# EAGLE schematic MySLipo_v2.0 (EAGLE 9.2.2)
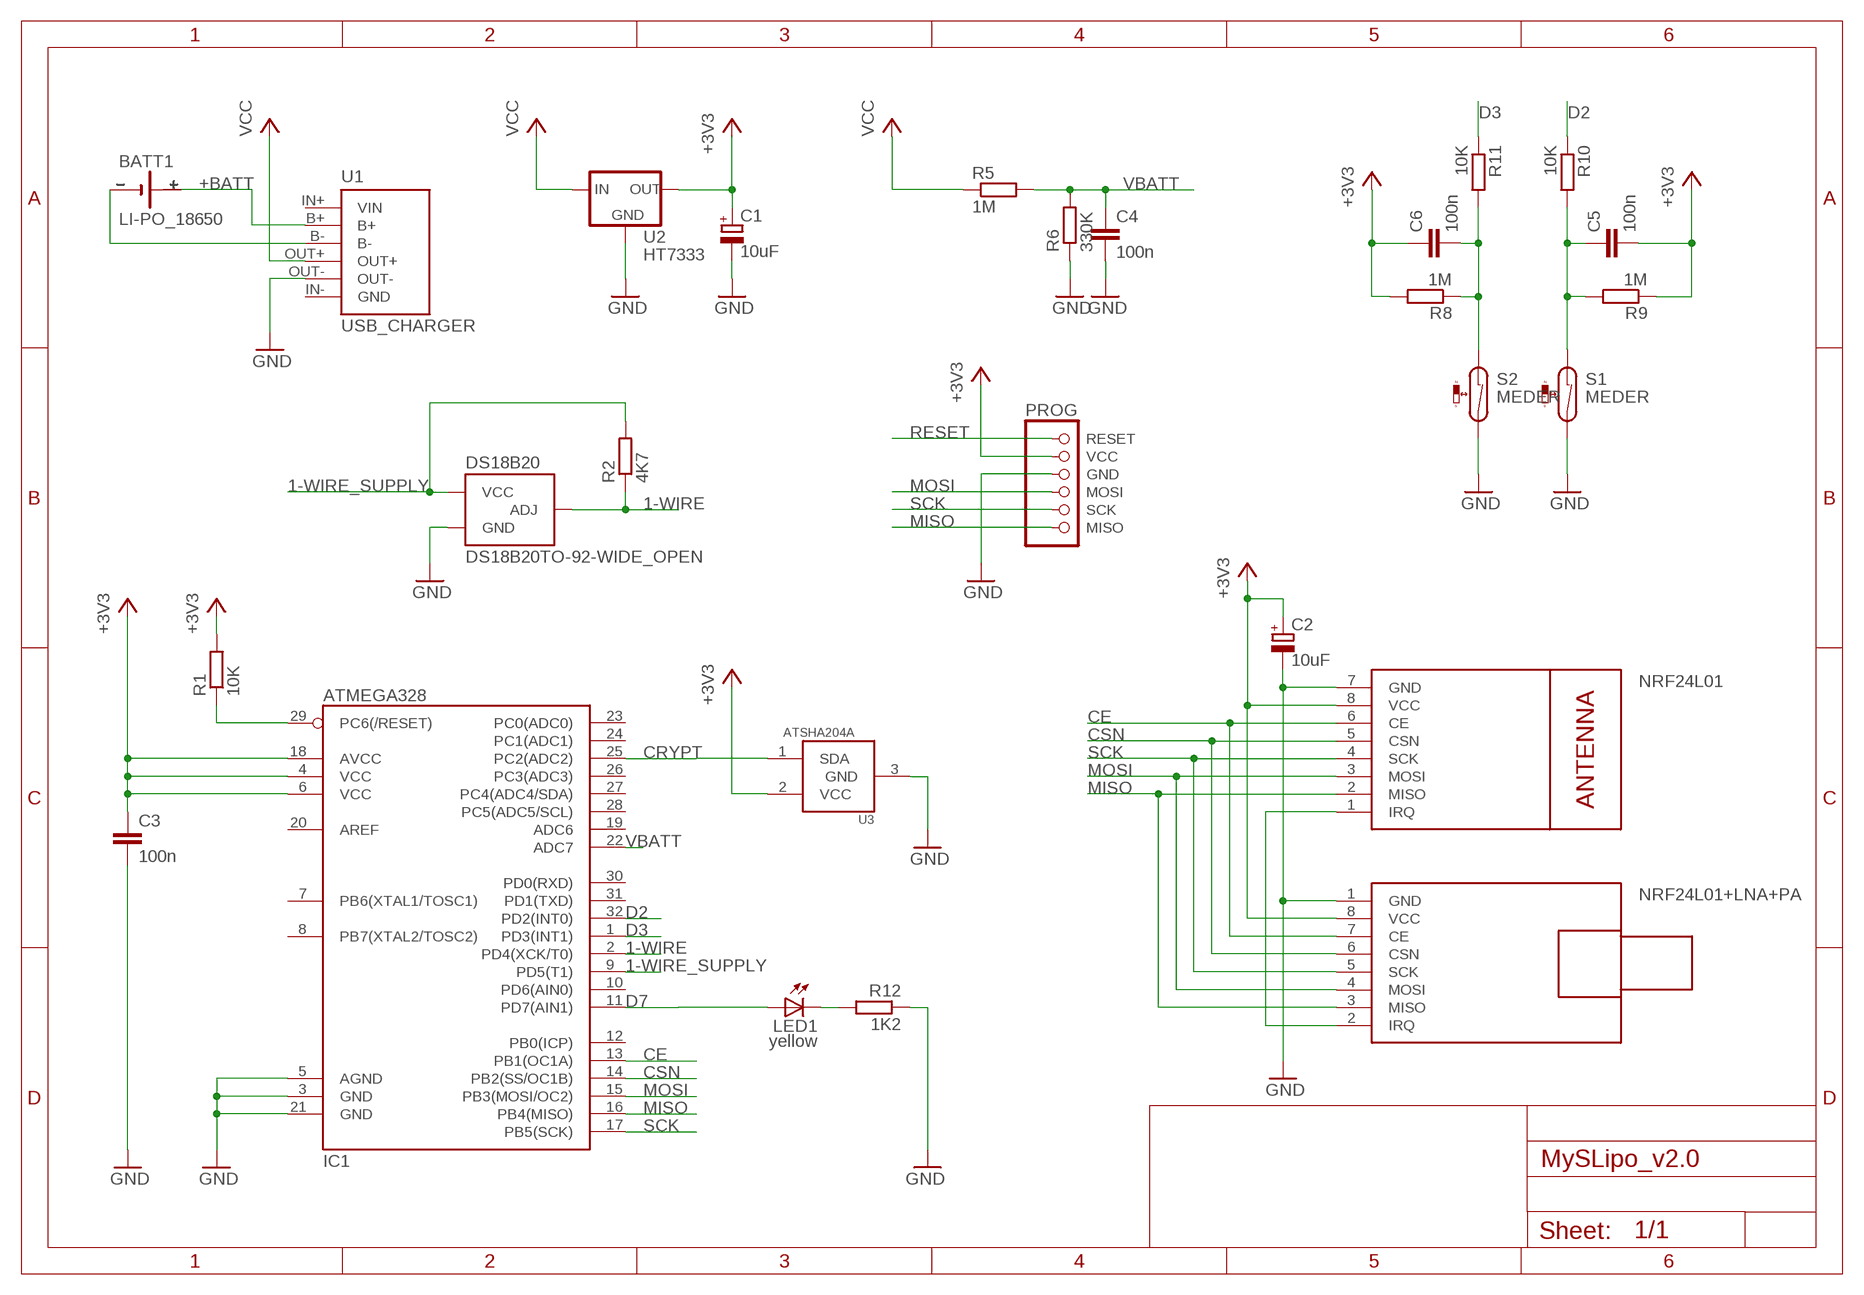
[diagram p0: schematic, sheet 1]

## Parts
BATT1  LI-PO_18650  SINGLE_BATTERY_HOLDER18650  [18650_HOLDER]
C1  10uF  CPOL-EUSMCA  [SMC_A]
C2  10uF  CPOL-EUSMCA  [SMC_A]
C3  100n  C-EUC0805  [C0805]
C4  100n  C-EUC0805  [C0805]
C5  100n  C-EUC0805  [C0805]
C6  100n  C-EUC0805  [C0805]
DS18B20  DS18B20TO-92-WIDE_OPEN  [TO-92-WIDE_OPEN]
IC1  ATMEGA328  [TQFP32-08]
LED1  yellow  LED  [LED_0805]
NRF24L01  WIRELESS-NRF24L01SMD2  [WIRELESS-NRF24L01-SMD-2]
NRF24L01+LNA+PA  WIRELESS-NRF24L01-PA-EXTSMD  [WIRELESS-NRF24L01-PA-SMD]
PROG  PROG  [PROG]
R1  10K  R-EU_R0805  [R0805]
R2  4K7  R-EU_R0805  [R0805]
R5  1M  R-EU_R0805  [R0805]
R6  330K  R-EU_R0805  [R0805]
R8  1M  R-EU_R0805  [R0805]
R9  1M  R-EU_R0805  [R0805]
R10  10K  R-EU_R0805  [R0805]
R11  10K  R-EU_R0805  [R0805]
R12  1K2  R-EU_R0805  [R0805]
S1  MEDER  [15X]
S2  MEDER  [15X]
U1  USB_CHARGER  [USB_CHARGER]
U2  HT7333  [SOT89]
U3  ATSHA204A  IC_ATSHA204A_CRYPT  [SOT23-3]

## Nets
1-WIRE: DS18B20.G(ADJ) IC1.2(PD4(XCK/T0)) R2.1
1-WIRE_SUPPLY: DS18B20.S(VCC) IC1.9(PD5(T1)) R2.2
+3V3: C1.+ C2.+ C3.1 C5.2 C6.1 IC1.4(VCC) IC1.6(VCC) IC1.18(AVCC) NRF24L01+LNA+PA.8(VCC) NRF24L01.8(VCC) PROG.2(VCC) R1.2 R8.2 R9.1 U2.3(OUT) U3.2(VCC)
+BATT: BATT1.+ U1.B+
CE: IC1.13(PB1(OC1A)) NRF24L01+LNA+PA.7(CE) NRF24L01.6(CE)
CRYPT: IC1.25(PC2(ADC2)) U3.1(SDA)
CSN: IC1.14(PB2(SS/OC1B)) NRF24L01+LNA+PA.6(CSN) NRF24L01.5(CSN)
D2: IC1.32(PD2(INT0)) R10.1
D3: IC1.1(PD3(INT1)) R11.1
D7: IC1.11(PD7(AIN1)) LED1.1(A)
GND: C1.- C2.- C3.2 C4.2 DS18B20.D(GND) IC1.3(GND) IC1.5(AGND) IC1.21(GND) NRF24L01+LNA+PA.1(GND) NRF24L01.7(GND) PROG.3(GND) R6.1 R12.1 S1.P$2 S2.P$2 U1.OUT- U2.1(GND) U3.3(GND)
MISO: IC1.16(PB4(MISO)) NRF24L01+LNA+PA.3(MISO) NRF24L01.2(MISO) PROG.6(MISO)
MOSI: IC1.15(PB3(MOSI/OC2)) NRF24L01+LNA+PA.4(MOSI) NRF24L01.3(MOSI) PROG.4(MOSI)
N$1: NRF24L01+LNA+PA.2(IRQ) NRF24L01.1(IRQ)
N$2: C5.1 R9.2 R10.2 S1.P$1
N$3: C6.2 R8.1 R11.2 S2.P$1
N$9: BATT1.- U1.B-
N$17: LED1.2(C) R12.2
RESET: IC1.29(PC6(/RESET)) PROG.1(RESET) R1.1
SCK: IC1.17(PB5(SCK)) NRF24L01+LNA+PA.5(SCK) NRF24L01.4(SCK) PROG.5(SCK)
VBATT: C4.1 IC1.22(ADC7) R5.2 R6.2
VCC: R5.1 U1.OUT+ U2.2(IN)
Unconnected: IC1.7(PB6(XTAL1/TOSC1)) IC1.8(PB7(XTAL2/TOSC2)) IC1.10(PD6(AIN0)) IC1.12(PB0(ICP)) IC1.19(ADC6) IC1.20(AREF) IC1.23(PC0(ADC0)) IC1.24(PC1(ADC1)) IC1.26(PC3(ADC3)) IC1.27(PC4(ADC4/SDA)) IC1.28(PC5(ADC5/SCL)) IC1.30(PD0(RXD)) IC1.31(PD1(TXD)) U1.IN+(VIN) U1.IN-(GND)

## Library data of the parts
BATT1 = moje:SINGLE_BATTERY_HOLDER: Li-Po battery
C1 C2 = rcl:CPOL-EU: POLARIZED CAPACITOR, European symbol
C3-C6 = rcl:C-EU: CAPACITOR, European symbol
DS18B20 = moje:DS18B20: TO-92 temp sensor
IC1 = moje:ATMEGA328
LED1 = mysensors:LED
NRF24L01 = nrf24l01plus:WIRELESS-NRF24L01: 2.4 GHz Wireless Module based on NRF24L01 chip
NRF24L01+LNA+PA = nrf24l01plus:WIRELESS-NRF24L01-PA-EXT: 2.4 GHz Wireless Module based on NRF24L01 chip with preamplifier and external antenna
PROG = moje:PROG: PIN HEADER
R1 R2 R5 R6 R8-R12 = rcl:R-EU_: RESISTOR, European symbol
S1 S2 = moje:MEDER: Reed switch
U1 = moje:USB_CHARGER
U2 = my-power:HT73*: LDO regulator
U3 = mysensors:IC_ATSHA204A_CRYPT